# Altium project T&H_ESP32_PCB_Layout.PrjPcb
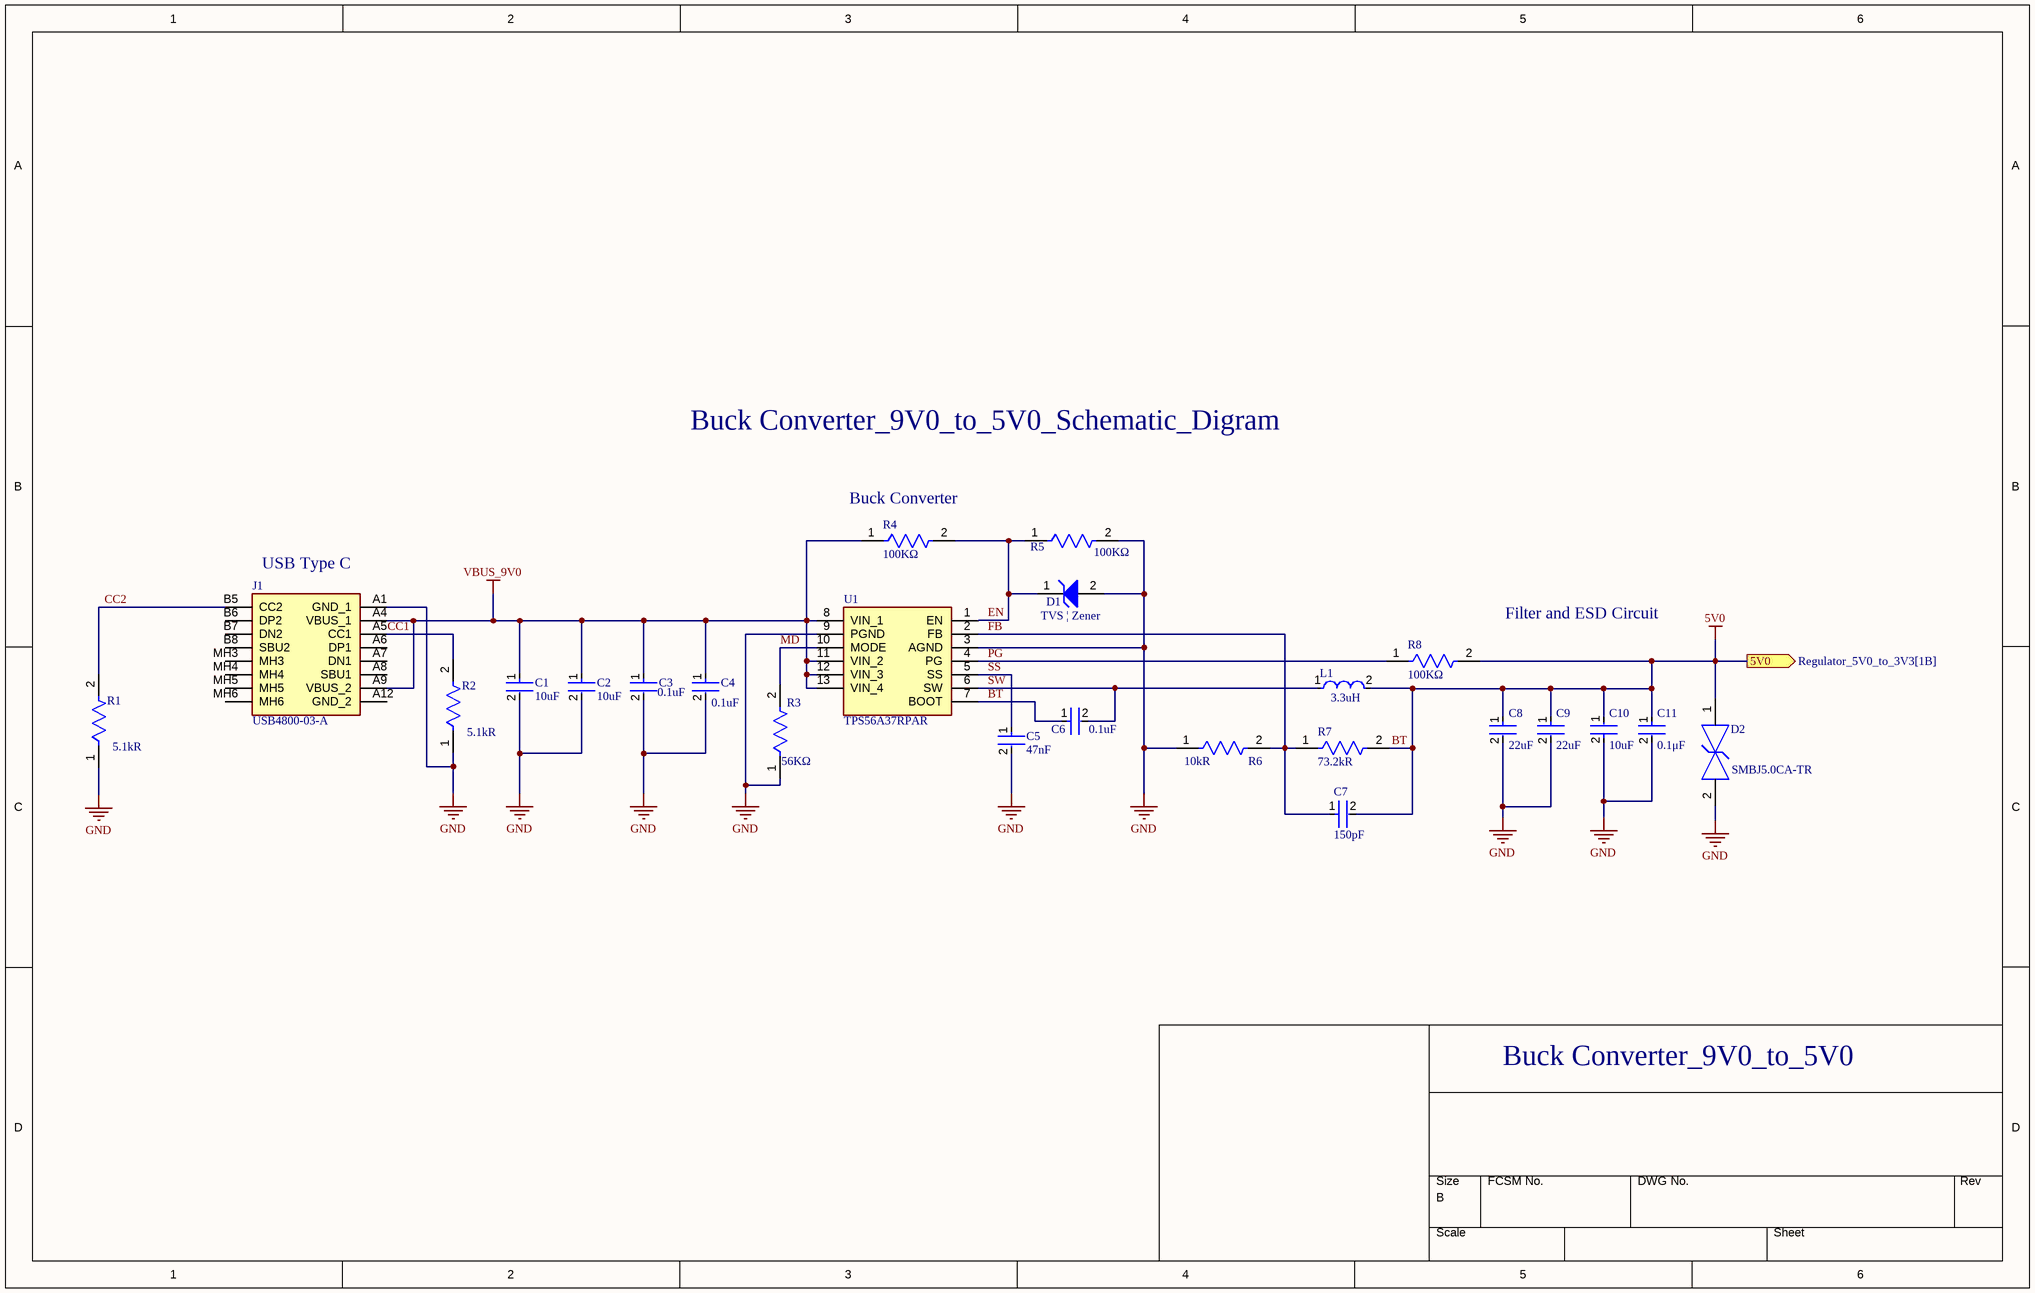
[diagram p0: Regulator_9V0_to_5V0.SchDoc]
3 sheets, 60 parts. Net scope: flat (ports and power ports of the same name join across sheets).
Board file: T&H_ESP32_PCB_Layout.PcbDoc
Sheets:
  Regulator_9V0_to_5V0.SchDoc
  Regulator_5V0_to_3V3.SchDoc
  ESP32_T&H_Interface.SchDoc

## Sheet Regulator_9V0_to_5V0.SchDoc: Buck Converter 9v to 5v0
size B; DocumentNumber: 1; Revision: 1; SheetNumber: 1; SheetTotal: 3

### Parts
C1  Capacitance: 10uF  [FP-CL21-IPC_C]  (hidden comment: CL21A106KOQNNNG)
C2  Capacitance: 10uF  [FP-CL21-IPC_C]  (hidden comment: CL21A106KOQNNNG)
C3  Capacitance: 0.1uF  [FP-0402-L_1_0_1-W_0_5_0_1-IPC_B]  (hidden comment: 0402YD104KAT2A)
C4  Capacitance: 0.1uF  [FP-0402-L_1_0_1-W_0_5_0_1-IPC_B]  (hidden comment: 0402YD104KAT2A)
C5  Capacitance: 47nF  [FP-CL579-IPC_C]  (hidden comment: CL05B473KO5NNNC)
C6  Capacitance: 0.1uF  [FP-0402-L_1_0_1-W_0_5_0_1-IPC_B]  (hidden comment: 0402YD104KAT2A)
C7  Capacitance: 150pF  [FP-C1005-050-0_05-IPC_B]  (hidden comment: C1005NP01H151J050BA)
C8  Capacitance: 22uF  [FP-CL10-IPC_B]  (hidden comment: CL10A226MO7JZNC)
C9  Capacitance: 22uF  [FP-CL10-IPC_B]  (hidden comment: CL10A226MO7JZNC)
C10  Capacitance: 10uF  [FP-C1608-080-0_1-IPC_A]  (hidden comment: C1608X5R1A106M080AC)
C11  Capacitance: 0.1μF  [FP-C0603C-CF-MFG]  (hidden comment: C0603C104K8RACTU)
D1  ESD5Z6.0T1G  [ONSC-SOD-523-2-502-01_V]  (value not drawn)
D2  SMBJ5.0CA-TR  [FP-SMB-CA-MFG]
J1  USB4800-03-A  [USB480003A]
L1  Inductance: 3.3uH  [FP-IHLP-2020CZ-FP_1_905x2-MFG]  (hidden comment: IHLP2020CZER3R3M11)
R1  Resistance: 5.1kR  [FP-CRCW0402-e3-IPC_C]  (hidden comment: CRCW04025K10FKED)
R2  Resistance: 5.1kR  [FP-CRCW0402-e3-IPC_C]  (hidden comment: CRCW04025K10FKED)
R3  Resistance: 56KΩ  [FP-CRGCQ0402-IPC_C]  (hidden comment: CRGCQ0402F56K)
R4  Resistance: 100KΩ  [FP-CRGP0402-IPC_C]  (hidden comment: CRGP0402F100K)
R5  Resistance: 100KΩ  [FP-CRGP0402-IPC_C]  (hidden comment: CRGP0402F100K)
R6  Resistance: 10kR  [FP-AC0402-MFG]  (hidden comment: AC0402FR-0710KL)
R7  Resistance: 73.2kR  [FP-RC1005-IPC_B]  (hidden comment: RC1005F7322CS)
R8  Resistance: 100KΩ  [FP-CRGP0402-IPC_C]  (hidden comment: CRGP0402F100K)
U1  TPS56A37RPAR  [TPS56A37RPAR]

### Ports
5V0 (out, see Regulator_5V0_to_3V3[1B])

### Nets
BT: C6.1 C7.2 C8.1 C9.1 C10.1 C11.1 D2.1 L1.2 R7.2 R8.2 U1.7(BOOT) ; port 5V0  [also labelled 5V0]
GND: C1.2 C2.2 C3.2 C4.2 C5.2 C8.2 C9.2 C10.2 C11.2 D1.2(A) D2.2 J1.A1(GND_1) R1.1 R2.1 R3.1 R5.2 R6.1 U1.3(AGND) U1.9(PGND)
VBUS_9V0: C1.1 C2.1 C3.1 C4.1 J1.A4(VBUS_1) J1.A9(VBUS_2) R4.1 U1.8(VIN_1) U1.11(VIN_2) U1.12(VIN_3) U1.13(VIN_4)
CC1: J1.A5(CC1) R2.2
CC2: J1.B5(CC2) R1.2
EN: D1.1(K) R4.2 R5.1 U1.1(EN)
FB: C7.1 R6.2 R7.1 U1.2(FB)
MD: R3.2 U1.10(MODE)
PG: R8.1 U1.4(PG)
SS: C5.1 U1.5(SS)
SW: C6.2 L1.1 U1.6(SW)

Not connected (* = marked no-connect by the designer): J1 A6(DP1) A7(DN1) A8(SBU1) A12(GND_2) B6(DP2) B7(DN2) B8(SBU2) MH3 MH4 MH5 MH6

### Notes on the sheet
- Buck Converter_9V0_to_5V0_Schematic_Digram
- (near R4) Buck Converter
- (near J1) USB Type C
- (near D1) TVS | Zener
- Filter and ESD Circuit
- Buck Converter_9V0_to_5V0
- DWG. NO.
- REV.
- SHT.
- THIS DOCUMENT AND THE DATA DISCLOSED HEREIN OR HEREWITH IS THE PROPERTY OF ALTIUM LIMITED AND MAY BE FREELY DISTRIBUTED IN WHOLE. NO RIGHTS ARE RESERVED OR EXPRESS OR IMPLIED WARANTEE GIVEN.
- REVISION
- DESCRIPTION
- DATE
- APPROVED
- ENG:
- APPROVALS
- PROJECT
- DSN:
- CHK:
- REFERENCE DOCUMENTS
- PROJECT REVISION:
- TITLE
- DOCUMENT REVISION:
- DESIGN ITEM:
- BOM:
- FAB DWG:
- PCB DWG:
- ASSY DWG:
- SCALE:
- SIZE
- B
- CAGE CODE
- FILE NAME
- DWG NO.
- SHEET
- OF
- REV

### Library data of the parts
C1 C2 = CMP-13271-002240-1: CL21 Series 0805 10uF 16V ±10% Tolerance X5R Multilayer Ceramic Chip Capacitor; Case Code (Metric): 2012; Package Quantity: 3000; Width: 0.049inch; Mount: Surface Mount; Depth: 1.25mm; Material: Ceramic; Min Operating Temperature: -55°C; Thickness: 0.053inch; Tolerance: 10%; Case Code (Imperial): 0805; Packaging: Tape and Reel; Voltage Rating: 16V; Case/Package: 0805; Height: 1.25mm; Voltage: 16V; Max Operating Temperature: 85°C; Length: 2mm; Dielectric: X5R
C3 C4 C6 = CMP-2008-02842-2: General Purpose Ceramic Capacitor, 0402, 10uF, 10%, X5R, 15%, 16V; Dissipation Factor: 3.5%; Case Code (Metric): 1005; Packaging: Tape and Reel; Voltage Rating: 16V; Voltage: 16V; REACH SVHC: No SVHC; Width: 0.02inch; Thickness: 0.022inch; Max Operating Temperature: 85°C; Dielectric: X5R; Mount: Surface Mount; Package Quantity: 1; Length: 1mm; Termination: SMD/SMT; Voltage Rating (DC): 16V; Construction: Flat; Contact Plating: Tin; Depth: 0.5mm; Tolerance: 10%; RoHS Compliant: Yes; Min Operating Temperature: -55°C; Case Code (Imperial): 0402; Height: 0.56mm; Case/Package: 0402; Radiation Hardening: No; Lead Free: Lead Free; Series: -
C5 = CMP-13271-000643-1: Cap Ceramic 47nF 16V X7R ±10% SMD 0402 +125°C Paper T/R; Voltage Rating (DC): 16V; Mount: Surface Mount; Max Operating Temperature: 125°C; Radiation Hardening: No; Voltage: 16V; Length: 1mm; Package Quantity: 1; Tolerance: 10%; Width: 0.02inch; Case/Package: 0402; Case Code (Metric): 1005; Height: 0.5mm; Packaging: Tape and Reel; Depth: 0.5mm; Lead Free: Lead Free; Min Operating Temperature: -55°C; Case Code (Imperial): 0402; Voltage Rating: 16V; Contact Plating: Tin; Dielectric: X7R; Thickness: 0.022inch
C7 = CMP-08246-007033-1: Multilayer Ceramic Capacitors 150pF ±5% 50V NP0 SMD 0402; Dielectric: C0G; Case Code (Imperial): 0402; Tolerance: 5%; Voltage Rating (DC): 50V; Max Operating Temperature: 150°C; RoHS Compliant: Yes; Packaging: Tape and Reel; Min Operating Temperature: -55°C; Series: C; Termination: SMD/SMT; Length: 0.039inch; Voltage Rating: 50V; Package Quantity: 10000; Weight: 2.3E-05oz; Height: 0.5mm; Mount: Surface Mount; Features: High Temperature; Width: 0.02inch; Thickness: 0.022inch; Case Code (Metric): 1005; Case/Package: 0402
C8 C9 = CMP-13271-002755-1: Cap Ceramic 22uF 16V X5R ±20% Pad SMD 0603 +85°C T/R; Mount: Surface Mount; Packaging: Tape and Reel; Case Code (Imperial): 0603; Max Operating Temperature: 85°C; Case/Package: 0603; Voltage Rating: 16V; Tolerance: 20%; Case Code (Metric): 1608; Min Operating Temperature: -55°C
C10 = CMP-2000-04980-2: Multilayer Ceramic Capacitors 10μF ±20% 10V X5R SMD 0603; Min Operating Temperature: -55°C; RoHS Compliant: Yes; Package Quantity: 1; Max Operating Temperature: 85°C; Radiation Hardening: No; Packaging: Tape and Reel; REACH SVHC: No SVHC; Length: 1.6mm; Case/Package: 0603; Series: C; Voltage Rating: 10V; Thickness: 0.035inch; Weight: 7.1E-05oz; Dielectric: X5R; Termination: SMD/SMT; Dielectric Material: Ceramic; Mount: Surface Mount; Construction: Flat; Resistor Type: Ceramic; Tolerance: 20%; Case Code (Metric): 1608; Number of Pins: 2; Case Code (Imperial): 0603; Depth: 0.8mm; Lead Free: Lead Free; Width: 0.031inch; Height: 0.8mm; Voltage Rating (DC): 10V
C11 = CMP-1035-02580-3: CAP CER 0.1UF 10V X7R 0603; Manufacturer: KEMET; Tolerance: 0.1; Material: Ceramic; Value: 0.10 μF; Temperature Coefficient: 30ppm/°C; Automotive Grade: Grade 1; Digikey Description: CAP CER 0.1UF 10V X7R 0603; Temperature Range High: +125°C; RoHS: TRUE; ComponentLink2URL: https://api.kemet.com/component-edge/download/datasheet/C0603C100J5GACAUTO.pdf; Lead Free: Yes; Device Class L2: Capacitors; Mouser Description: Multilayer Ceramic Capacitors MLCC - SMD/SMT 10volts 0.1uF X7R 10%; Temperature: -55°C to +125°C; Category: Cap; Height: 0.87mm; Voltage Rating: 10 V; Device Class L3: Ceramic Capacitors; ComponentLink2Description: Datasheet; Automotive: Yes; Manufacturer Part Number: C0603C104K8RACTU; Octopart: https://octopart.com/c0603c104k8ractu-kemet-145075; Temperature Characteristic: X7R; Device Class L1: Passive Components; Temperature Range Low: -55°C; Package: C0603C-CF
D1 = CMP-1063-00101-1: Transient Voltage Suppressor, Micro-Packaged Diode for ESD Protection, 2-Pin SOD-523, Pb-Free, Tape and Reel; Manufacturer: On Semiconductor; PPK Max (W): 181; Direction: Unidirectional; Number of Lines: 1; V(BR) Min (V): 6.8; IR Max (uA): 0.01; VRWM Max (V): 6; Packing: Tape and Reel; PackageReference: SOD-523-2-502-01; Mounting Technology: Surface Mount; RoHS: Pb-Free; ComponentLink2Description: Datasheet; PackageVersion: Rev. E, 09/2010; ComponentLink2URL: http://www.onsemi.cn/pub_link/Collateral/ESD5Z2.5T1-D.PDF; PackageDescription: 2-Pin SOD, Body 1.2 x 0.8 mm; DatasheetVersion: Rev. 10; ComponentLink3Description: Package Specification; ComponentLink3URL: http://www.onsemi.com/pub_link/Collateral/502-01.PDF; ComponentLink1URL: http://www.onsemi.com/; ComponentLink1Description: Manufacturer URL; PartNumber: ESD5Z6.0T1G
D2 = CMP-12225-000020-1: TVS DIODE 5V 13.4V SMB; Manufacturer: STMicroelectronics; Max Junction Temp: +150°C; Number Of Channels: 1; Peak Pulse Current: 68A; Standoff Height: 0.05mm; Direction: Bidirectional; Peak Pulse Power: 600W; Clamping Voltage: 9.2V; Breakdown Voltage: 6.4V; Manufacturer Part Number: SMBJ5.0CA-TR; Device Class L3: unset; Temperature Range Low: -55°C; Digikey Description: TVS DIODE 5V 13.4V SMB; Device Class L2: TVS Diodes; Mouser Description: TVS Diodes - Transient Voltage Suppressors 600W 5.0V Bidirect; Height: 2.65mm; ComponentLink2Description: Datasheet; Lead Free: Yes; RoHS: TRUE; Device Class L1: Circuit Protection; Package: SMB-CA; Reverse Standoff Voltage: 5V; ComponentLink2URL: https://www.st.com/content/ccc/resource/technical/document/datasheet/19/78/91/39/07/cd/40/65/CD00001366.pdf/files/CD00001366.pdf/_jcr_content/translations/en.CD00001366.pdf; Temperature: -55°C to +150°C; Automotive: No; Octopart: https://octopart.com/smbj5.0ca-tr-stmicroelectronics-347080; Temperature Range High: +150°C; Category: Diode
J1 = USB4800-03-A: Connector; Manufacturer_Name: GCT (GLOBAL CONNECTOR TECHNOLOGY); Datasheet Link: https://gct.co/connector/usb4800; Height: 5.58mm; Manufacturer_Part_Number: USB4800-03-A; Mouser Part Number: 640-USB4800-03-A; Mouser Price/Stock: https://www.mouser.co.uk/ProductDetail/GCT/USB4800-03-A?qs=vvQtp7zwQdMkfG8vViEZoQ%3D%3D
L1 = CMP-02424-000463-1: Fixed Inductors Commercial Low DCR Series 3.3uH 5.5A 40.4mΩ 20%; DC Resistance (DCR): 40.4mR; Self Resonant Frequency: 29MHz; Saturation Current: 7A; Test Frequency: 100kHz; Shielding: Shielded; Depth: 5.43mm; Termination: SMD/SMT; Width: 0.204inch; Packaging: Tape and Reel; Height: 3mm; Height - Seated (Max): 0.118inch; Military Standard: Not; RMS Current (Irms): 5.5A; Current Rating: 5.5A; Radiation Hardening: No; Case/Package: 2020; Tolerance: 20%; Min Operating Temperature: -55°C; Package Quantity: 2000; Contact Plating: Tin; Mount: Surface Mount; Inductance Tolerance: 20%; Length: 5.74mm; Lead Free: Lead Free; Max DC Current: 7A; Max Operating Temperature: 125°C
R1 R2 = CMP-1011-00590-4: RES Thick Film, 5.1kΩ, 1%, 0.063W, 100ppm/°C, 0402; Voltage Rating: 50V; Max Power Dissipation: 63mW; Case/Package: 0402; Min Operating Temperature: -55°C; Height: 0.35mm; Contact Plating: Tin; Tolerance: 1%; Max Operating Temperature: 155°C; Lead Free: Lead Free; Number of Terminations: 2; Temperature Coefficient: 100ppm/°C; Weight: 2.3E-05oz; Termination: SMD/SMT; Radiation Hardening: No; Voltage Rating (DC): 50V; Length: 1mm; Features: Automotive AEC-Q200; Case Code (Metric): 1005; Width: 0.02inch; Package Quantity: 10; Military Standard: Not; Depth: 0.5mm; Packaging: Tape and Reel; Power Rating: 63mW; Case Code (Imperial): 0402; Composition: Thick Film
R3 = CMP-03211-009184-1: CRGCQ 0402 56K 1%; Manufacturer: TE Connectivity; Temperature Coefficient: ±100ppm/°C; Value: 56KΩ; Voltage Rating: 50V; Power Rating: 0.0625W; Tolerance: 0.01; Device Class L3: Chip SMD Resistors; ComponentLink2URL: https://www.te.com/commerce/DocumentDelivery/DDEController?Action=showdoc&DocId=Data+Sheet%7F1773204-3%7F1%7Fpdf%7FEnglish%7FENG_DS_1773204-3_1.pdf%7F4-2176347-1092; RoHS: TRUE; Octopart: https://octopart.com/crgcq0402f56k-te+connectivity-91017978; Composition: Thick Film; Height: 0.4mm; Ipc Land Pattern Name: RESC10050X35; Series: CRGCQ; Device Class L2: Resistors; Temperature: -55°C to +155°C; Manufacturer Part Number: CRGCQ0402F56K; Device Class L1: Passive Components; Temperature Range Low: -55°C; Digikey Description: CRGCQ 0402 56K 1%; Lead Free: Yes; Automotive: Yes; ComponentLink2Description: Datasheet; Temperature Range High: +155°C; Ambient Temperature Range High: +70°C; Package: CRGCQ0402; Category: Res
R4 R5 R8 = CMP-03211-001392-1: SMD Precision Pulse Thick Film Chip Resistor; Manufacturer: TE; Value: 100KΩ; Power Rating: 0.125W; Tolerance: 0.01; Temperature Coefficient: ±100ppm/°C; Voltage Rating: 50V; Octopart: https://octopart.com/crgp0402f100k-te+connectivity-91018658; Ipc Land Pattern Name: RESC11050X35; Digikey Description: SMD Precision Pulse Thick Film Chip Resistor; Composition: Thick Film; Device Class L3: Chip SMD Resistors; Package: CRGP0402; Manufacturer Part Number: CRGP0402F100K; Temperature: -55°C to +155°C; Category: Res; Device Class L1: Passive Components; Temperature Range High: +155°C; ComponentLink2URL: https://www.mouser.ca/datasheet/2/418/NG_DS_9-1773463-9_A-1358566.pdf; Temperature Range Low: -55°C; Series: CRGP; Automotive: No; Lead Free: Yes; RoHS: TRUE; Device Class L2: Resistors; Height: 0.4mm; ComponentLink2Description: Datasheet
R6 = CMP-2002-01790-3: RES 10kΩ ±1% 0.063W 0402; Power Rating: 62.5mW; Voltage Rating: 50V; Temperature Coefficient: 100ppm/°C; Max Power Dissipation: 63mW; Tolerance: 1%; Military Standard: Not; Construction: Rectangular; Termination: SMD/SMT; Max Operating Temperature: 155°C; Min Operating Temperature: -55°C; Height: 0.015inch; Lead Free: Lead Free; Width: 0.02inch; Case/Package: 0402; Resistor Type: Thick Film; Series: AC; Features: Moisture Resistant; RoHS Compliant: Yes; Number of Terminations: 2; Case Code (Metric): 1005; Length: 0.039inch; Depth: 0.5mm; Size Code: 0402; Packaging: Tape and Reel; Case Code (Imperial): 0402
R7 = CMP-13261-004133-1: Res Thick Film 0402 73.2kΩ 1% 0.063W ±100ppm/°C Molded SMD T/R; Voltage Rating (DC): 50V; Power Rating: 63mW; Tolerance: 1%; Contact Plating: Tin; Features: Moisture Resistant; Case Code (Imperial): 0402; Length: 1mm; Lead Free: Lead Free; Case Code (Metric): 1005; Packaging: Tape and Reel; Number of Terminations: 2; Max Operating Temperature: 155°C; Military Standard: Not; Height: 0.016inch; Case/Package: 0402; Radiation Hardening: No; Depth: 0.5mm; Min Operating Temperature: -55°C; Temperature Coefficient: 100ppm/°C; Max Power Dissipation: 63mW; Composition: Thick Film; Width: 0.02inch; Package Quantity: 1
U1 = TPS56A37RPAR: Integrated Circuit; Manufacturer_Name: Texas Instruments; Datasheet Link: https://www.ti.com/lit/ds/symlink/tps56a37.pdf?ts=1708310049261&ref_url=https%253A%252F%252Fwww.ti.com%252Fproduct%252FTPS56A37; Height: 1mm; Manufacturer_Part_Number: TPS56A37RPAR; Mouser Part Number: 595-TPS56A37RPAR; Mouser Price/Stock: https://www.mouser.co.uk/ProductDetail/Texas-Instruments/TPS56A37RPAR?qs=dbcCsuKDzFV3BmG4b9YeGQ%3D%3D; Arrow Part Number: TPS56A37RPAR; Arrow Price/Stock: https://www.arrow.com/en/products/tps56a37rpar/texas-instruments?utm_currency=USD&region=nac

## Sheet Regulator_5V0_to_3V3.SchDoc: Linear Voltage Regulator_5V0_to_3V3
size A4; Date: 03/08/2025; DocumentNumber: 2; Revision: 0; SheetNumber: 2; SheetTotal: 3
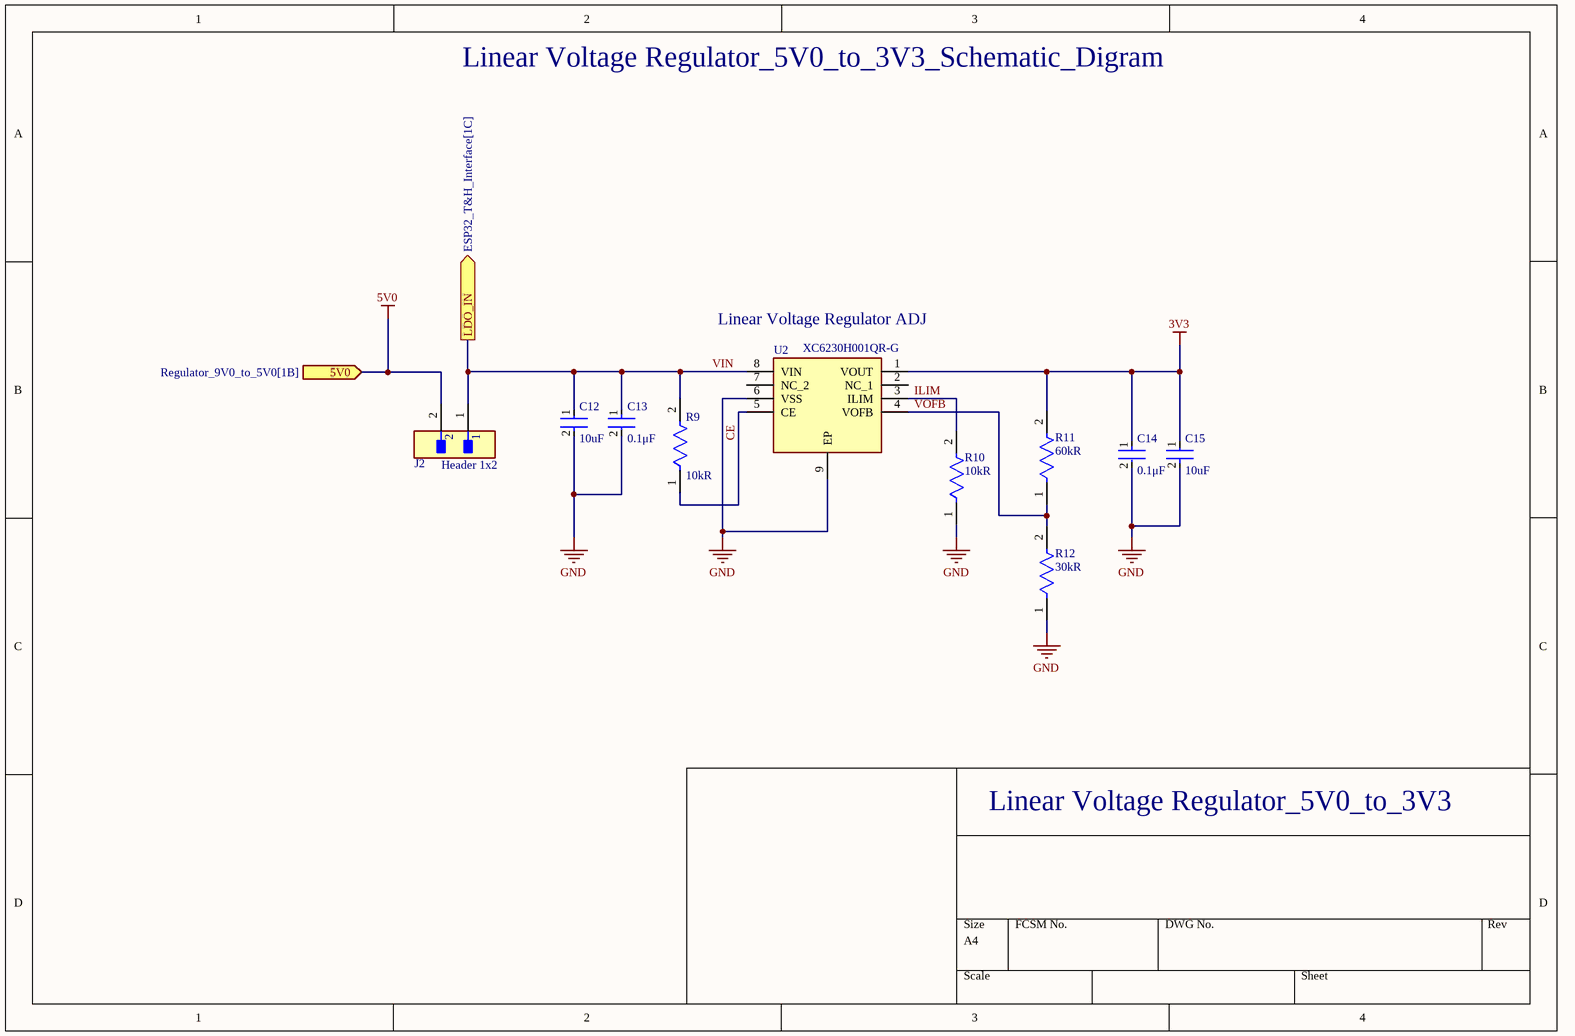
[diagram p1: Regulator_5V0_to_3V3.SchDoc]

### Parts
C12  Capacitance: 10uF  [FP-C1608-080-0_1-IPC_A]  (hidden comment: C1608X5R1A106M080AC)
C13  Capacitance: 0.1μF  [FP-C0603C-CF-MFG]  (hidden comment: C0603C104K8RACTU)
C14  Capacitance: 0.1μF  [FP-C0603C-CF-MFG]  (hidden comment: C0603C104K8RACTU)
C15  Capacitance: 10uF  [FP-C1608-080-0_1-IPC_A]  (hidden comment: C1608X5R1A106M080AC)
J2  Header 1x2  [FP-M20-9990245-MFG]
R9  Resistance: 10kR  [FP-AC0402-MFG]  (hidden comment: AC0402FR-0710KL)
R10  Resistance: 10kR  [FP-AC0402-MFG]  (hidden comment: AC0402FR-0710KL)
R11  Resistance: 60kR  [FP-MCR01-IPC_A]  (hidden comment: MCR01MRTF3002)
R12  Resistance: 30kR  [FP-MCR01-IPC_A]  (hidden comment: MCR01MRTF3002)
U2  XC6230H001QR-G  [XC6230H001]

### Ports
5V0 (in, see Regulator_9V0_to_5V0[1B]), LDO_IN (out, see ESP32_T&H_Interface[1C])

### Nets
3V3: C14.1 C15.1 R11.2 U2.1(VOUT)
5V0: J2.2 ; port 5V0  [project net BT]
GND: C12.2 C13.2 C14.2 C15.2 R10.1 R12.1 U2.6(VSS) U2.9(EP)
CE: R9.1 U2.5(CE)
ILIM: R10.2 U2.3(ILIM)
VIN: C12.1 C13.1 J2.1 R9.2 U2.8(VIN) ; port LDO_IN
VOFB: R11.1 R12.2 U2.4(VOFB)

Not connected (* = marked no-connect by the designer): U2 2(NC_1) 7(NC_2)

### Notes on the sheet
- Linear Voltage Regulator_5V0_to_3V3_Schematic_Digram
- (near U2) Linear Voltage Regulator ADJ
- Linear Voltage Regulator_5V0_to_3V3

### Library data of the parts
C12 C15 = CMP-2000-04980-2: as C10 on sheet Regulator_9V0_to_5V0; Min Operating Temperature: -55°C; RoHS Compliant: Yes; Package Quantity: 1; Max Operating Temperature: 85°C; Radiation Hardening: No; Packaging: Tape and Reel; REACH SVHC: No SVHC; Length: 1.6mm; Case/Package: 0603; Series: C; Voltage Rating: 10V; Thickness: 0.035inch; Weight: 7.1E-05oz; Dielectric: X5R; Termination: SMD/SMT; Dielectric Material: Ceramic; Mount: Surface Mount; Construction: Flat; Resistor Type: Ceramic; Tolerance: 20%; Case Code (Metric): 1608; Number of Pins: 2; Case Code (Imperial): 0603; Depth: 0.8mm; Lead Free: Lead Free; Width: 0.031inch; Height: 0.8mm; Voltage Rating (DC): 10V
C13 C14 = CMP-1035-02580-3: as C11 on sheet Regulator_9V0_to_5V0; Digikey Description: CAP CER 0.1UF 10V X7R 0603; Temperature Range High: +125°C; RoHS: TRUE; ComponentLink2URL: https://api.kemet.com/component-edge/download/datasheet/C0603C100J5GACAUTO.pdf; Lead Free: Yes; Device Class L2: Capacitors; Mouser Description: Multilayer Ceramic Capacitors MLCC - SMD/SMT 10volts 0.1uF X7R 10%; Temperature: -55°C to +125°C; Category: Cap; Height: 0.87mm; Voltage Rating: 10 V; Device Class L3: Ceramic Capacitors; ComponentLink2Description: Datasheet; Automotive: Yes; Manufacturer Part Number: C0603C104K8RACTU; Octopart: https://octopart.com/c0603c104k8ractu-kemet-145075; Temperature Characteristic: X7R; Device Class L1: Passive Components; Temperature Range Low: -55°C; Package: C0603C-CF
J2 = CMP-15831-000105-1: CONN HEADER VERT 2POS 2.54MM; Working Voltage: 750V; Gender: Male; Number of Poles: 2; Current Rating: 3A; Mated Stacking Heights: 16.54mm; Contact Resistance: 25mR; Connector Type: Male Pin; Insulation Resistance: 10GR; Mating Cycles: 300; Voltage: 50V; Flammability Rating: UL94 V-0; Pitch: 2.54mm; Series: M20; Number of Contacts: 2; Height: 0.12inch; Min Operating Temperature: -40°C; Contact Finish - Mating: GOLD; Number of Positions: 2; Number of Rows: 1; Packaging: Bulk; Package Quantity: 1000; Voltage Rating (AC): 750V; Current: 3A; Mount: Through Hole; Case/Package: SIL; Orientation: Straight; Contact Shape: Square; Weight: 0.25lb; Radiation Hardening: No; Fastening Type: Pull; Length: 5.08mm; Depth: 2.54mm; Contact Mating Length: 0.24inch; Housing Material: Nylon; Reach SVHC Compliant: Yes; Insulation Material: Nylon; Color: Black; Width: 0.25inch; Insulation Color: Black; Contact Material: Brass; Contact Type: Male Pin; Termination: Solder; Max Operating Temperature: 105°C; Contact Plating: Gold; Housing Color: Black; Max Current Rating: 3A; Lead Pitch: 2.54mm
R9 R10 = CMP-2002-01790-3: as R6 on sheet Regulator_9V0_to_5V0; Tolerance: 1%; Military Standard: Not; Construction: Rectangular; Termination: SMD/SMT; Max Operating Temperature: 155°C; Min Operating Temperature: -55°C; Height: 0.015inch; Lead Free: Lead Free; Width: 0.02inch; Case/Package: 0402; Resistor Type: Thick Film; Series: AC; Features: Moisture Resistant; RoHS Compliant: Yes; Number of Terminations: 2; Case Code (Metric): 1005; Length: 0.039inch; Depth: 0.5mm; Size Code: 0402; Packaging: Tape and Reel; Case Code (Imperial): 0402
R11 = CMP-08839-016222-1: Thick Film Chip Resistor, 0402, 60kΩ, 1%, 100ppm/°C, 0.063W, 50V; Max Power Dissipation: 63mW; Voltage Rating (DC): 50V; Min Operating Temperature: -55°C; Case Code (Metric): 1005; RoHS Compliant: Yes; Case/Package: 0402; Number of Terminations: 2; Case Code (Imperial): 0402; Height: 0.016inch; Tolerance: 1%; Resistor Type: Thick Film; Length: 0.039inch; Max Operating Temperature: 155°C; Temperature Coefficient: 100ppm/°C; Package Quantity: 10000; Packaging: Tape and Reel; Width: 0.02inch
R12 = CMP-08839-016222-1: Thick Film Chip Resistor, 0402, 30kΩ, 1%, 100ppm/°C, 0.063W, 50V; Max Power Dissipation: 63mW; Voltage Rating (DC): 50V; Min Operating Temperature: -55°C; Case Code (Metric): 1005; RoHS Compliant: Yes; Case/Package: 0402; Number of Terminations: 2; Case Code (Imperial): 0402; Height: 0.016inch; Tolerance: 1%; Resistor Type: Thick Film; Length: 0.039inch; Max Operating Temperature: 155°C; Temperature Coefficient: 100ppm/°C; Package Quantity: 10000; Packaging: Tape and Reel; Width: 0.02inch
U2 = XC6230H001QR-G: Integrated Circuit; Manufacturer_Name: Torex; Datasheet Link: https://torex.componentsearchengine.com/Datasheets/2/XC6230H001QR-G.pdf; Height: 1.75mm; Manufacturer_Part_Number: XC6230H001QR-G; Mouser Part Number: 865-XC6230H001QR-G; Mouser Price/Stock: https://www.mouser.co.uk/ProductDetail/Torex-Semiconductor/XC6230H001QR-G?qs=T3oQrply3y%252BzJb5jKbBeQw%3D%3D

## Sheet ESP32_T&H_Interface.SchDoc
size A; SheetNumber: 3; SheetTotal: 3
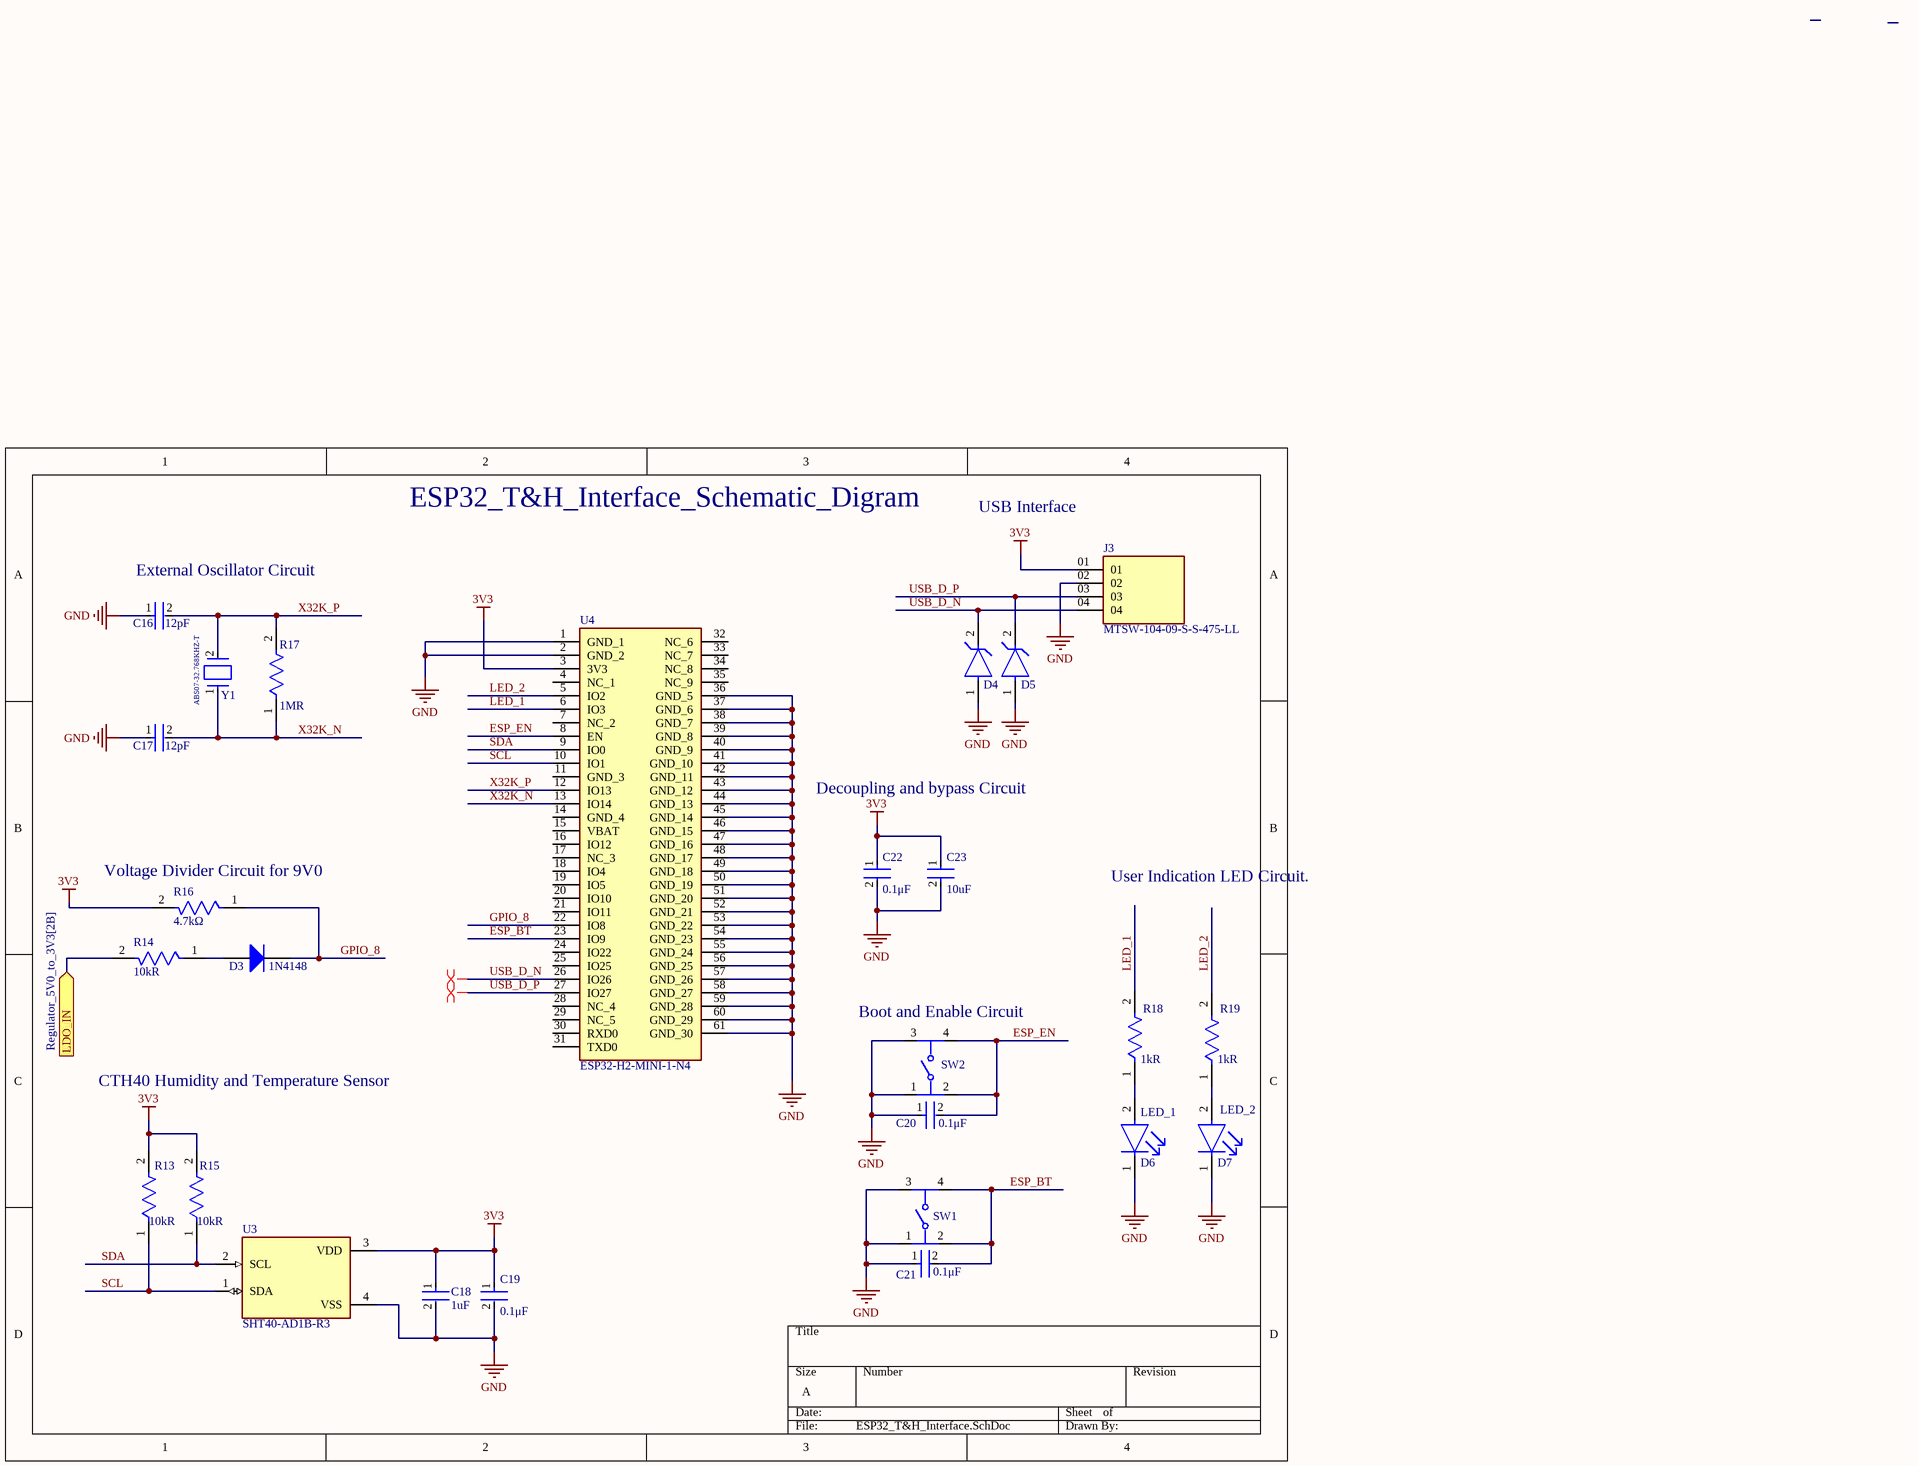
[diagram p2: ESP32_T&H_Interface.SchDoc]

### Parts
C16  Capacitance: 12pF  [FP-0402-L_1_0_1-W_0_5_0_1-IPC_B]  (hidden comment: 04025A120JAT2A)
C17  Capacitance: 12pF  [FP-0402-L_1_0_1-W_0_5_0_1-IPC_B]  (hidden comment: 04025A120JAT2A)
C18  Capacitance: 1uF  [FP-GRM15-0_1-MFG]  (hidden comment: GRM155R61A105KE15D)
C19  Capacitance: 0.1μF  [FP-C0603C-CF-MFG]  (hidden comment: C0603C104K8RACTU)
C20  Capacitance: 0.1μF  [FP-C0603C-CF-MFG]  (hidden comment: C0603C104K8RACTU)
C21  Capacitance: 0.1μF  [FP-C0603C-CF-MFG]  (hidden comment: C0603C104K8RACTU)
C22  Capacitance: 0.1μF  [FP-C0603C-CF-MFG]  (hidden comment: C0603C104K8RACTU)
C23  Capacitance: 10uF  [FP-C1608-080-0_1-IPC_A]  (hidden comment: C1608X5R1A106M080AC)
D3  1N4148  [DIOD-SOD323-2-A_V]
D4  UCLAMP3601P.TNT  [FP-SLP1006P2-MFG]  (value not drawn)
D5  UCLAMP3601P.TNT  [FP-SLP1006P2-MFG]  (value not drawn)
D6  APHHS1005CGCK  [FP-APHHS1005CGCK-MFG]  (value not drawn)
D7  APHHS1005CGCK  [FP-APHHS1005CGCK-MFG]  (value not drawn)
J3  MTSW-104-09-S-S-475-LL  [SAMTEC_MTSW-104-09-S-S-475-LL]
R13  Resistance: 10kR  [FP-AC0402-MFG]  (hidden comment: AC0402FR-0710KL)
R14  Resistance: 10kR  [FP-AC0402-MFG]  (hidden comment: AC0402FR-0710KL)
R15  Resistance: 10kR  [FP-AC0402-MFG]  (hidden comment: AC0402FR-0710KL)
R16  Resistance: 4.7kΩ  [FP-RC0402-0_4-MFG]  (hidden comment: RC0402JR-074K7L)
R17  Resistance: 1MR  [FP-MCR01-IPC_B]  (hidden comment: MCR01MRTF1004)
R18  Resistance: 1kR  [FP-RMCF0402-MFG]  (hidden comment: RMCF0402FT1K00)
R19  Resistance: 1kR  [FP-RMCF0402-MFG]  (hidden comment: RMCF0402FT1K00)
SW1  KMR221NGLFS  [FP-KMR221NGLFS-0]  (value not drawn)
SW2  KMR221NGLFS  [FP-KMR221NGLFS-0]  (value not drawn)
U3  SHT40-AD1B-R3  [SHT4X]
U4  ESP32-H2-MINI-1-N4  [ESP32H2MINI1N4]
Y1  ABS07-32.768KHZ-T  [FP-ABS07-MFG]

### Ports
LDO_IN (in, see Regulator_5V0_to_3V3[2B])

### Nets
3V3: C18.1 C19.1 C22.1 C23.1 J3.01 R13.2 R15.2 R16.2 U3.3(VDD) U4.3(3V3)
GND: C16.1 C17.1 C18.2 C19.2 C20.1 C21.1 C22.2 C23.2 D4.1(A) D5.1(A) D6.1(C) D7.1(C) J3.02 SW1.1 SW1.3 SW2.1 SW2.3 U3.4(VSS) U4.1(GND_1) U4.2(GND_2) U4.36(GND_5) U4.37(GND_6) U4.38(GND_7) U4.39(GND_8) U4.40(GND_9) U4.41(GND_10) U4.42(GND_11) U4.43(GND_12) U4.44(GND_13) U4.45(GND_14) U4.46(GND_15) U4.47(GND_16) U4.48(GND_17) U4.49(GND_18) U4.50(GND_19) U4.51(GND_20) U4.52(GND_21) U4.53(GND_22) U4.54(GND_23) U4.55(GND_24) U4.56(GND_25) U4.57(GND_26) U4.58(GND_27) U4.59(GND_28) U4.60(GND_29) U4.61(GND_30)
ESP_BT: C21.2 SW1.2 SW1.4 U4.23(IO9)
ESP_EN: C20.2 SW2.2 SW2.4 U4.8(EN)
GPIO_8: D3.2(K) R16.1 U4.22(IO8)
LED_1: R18.2 U4.6(IO3)
LED_2: R19.2 U4.5(IO2)
SCL: R13.1 U3.1(SDA) U4.10(IO1)
SDA: R15.1 U3.2(SCL) U4.9(IO0)
USB_D_N: D4.2(C) J3.04 U4.26(IO26)
USB_D_P: D5.2(C) J3.03 U4.27(IO27)
VIN: R14.2 ; port LDO_IN
X32K_N: C17.2 R17.1 U4.13(IO14) Y1.1
X32K_P: C16.2 R17.2 U4.12(IO13) Y1.2
NetD3_1: D3.1(A) R14.1
NetD6_2: D6.2(A) R18.1
NetD7_2: D7.2(A) R19.1

Not connected (* = marked no-connect by the designer): U4 4(NC_1) 7(NC_2) 11(GND_3) 14(GND_4) 15(VBAT) 16(IO12) 17(NC_3) 18(IO4) 19(IO5) 20(IO10) 21(IO11) 24(IO22) 25(IO25) 28(NC_4) 29(NC_5) 30(RXD0) 31(TXD0) 32(NC_6) 33(NC_7) 34(NC_8) 35(NC_9)

### Layout directives
differential pair: USB_D_N, USB_D_P

### Notes on the sheet
- ESP32_T&H_Interface_Schematic_Digram
- USB Interface
- (near C16) External Oscillator Circuit
- Decoupling and bypass Circuit
- (near R16) Voltage Divider Circuit for 9V0
- User Indication LED Circuit.
- (near SW2) Boot and Enable Circuit
- CTH40 Humidity and Temperature Sensor
- (near D6) LED_1
- (near D7) LED_2

### Library data of the parts
C16 C17 = CMP-2008-02574-2: General Purpose Ceramic Capacitor, 0402, 12pF, 5%, C0G, 30ppm/°C, 50V; Insulation Resistance: 100GR; Radiation Hardening: No; RoHS Compliant: Yes; Voltage Rating: 50V; Case Code (Imperial): 0402; Height: 0.5mm; Voltage: 50V; Voltage Rating (DC): 50V; Mount: Surface Mount; Thickness: 0.022inch; Depth: 0.5mm; Max Operating Temperature: 125°C; Construction: Flat; Termination: SMD/SMT; Tolerance: 5%; Length: 1mm; Lead Free: Lead Free; Dielectric: C0G; Number of Pins: 2; Package Quantity: 1; Series: -; Temperature Coefficient: 30ppm/°C; Min Operating Temperature: -55°C; Case/Package: 0402; Packaging: Tape and Reel; Case Code (Metric): 1005; Width: 0.02inch; REACH SVHC: No SVHC
C18 = CMP-2008-04556-2: CAP CER 1UF 10V X5R 0402; Manufacturer: Murata; Material: Ceramic; Tolerance: 10%; Temperature Coefficient: 15%; Octopart: https://octopart.com/grm155r61a105ke15d-murata-197442; Manufacturer Part Number: GRM155R61A105KE15D; Lead Free: Yes; ComponentLink2Description: Datasheet; Temperature: -55°C to +85°C; Temperature Range High: +85°C; Height: 0.55mm; Ipc Land Pattern Name: CAPC10050X50; ComponentLink2URL: https://search.murata.co.jp/Ceramy/image/img/A01X/G101/ENG/GRM155R61A105KE15-01A.pdf; Temperature Range Low: -55°C; Device Class L2: Capacitors; Voltage Rating: 10V; RoHS: TRUE; Device Class L1: Passive Components; Device Class L3: Ceramic Capacitors; Temperature Characteristic: X5R; Mouser Description: 0402 1 uF 10 V ±10% Tolerance X5R Surface Mount Multilayer Ceramic Capacitor; Automotive: No; Package: GRM15-0.1; Digikey Description: CAP CER 1UF 10V X5R 0402; Value: 1uF; Category: Cap
C19-C22 = CMP-1035-02580-3: as C11 on sheet Regulator_9V0_to_5V0; Digikey Description: CAP CER 0.1UF 10V X7R 0603; Temperature Range High: +125°C; RoHS: TRUE; ComponentLink2URL: https://api.kemet.com/component-edge/download/datasheet/C0603C100J5GACAUTO.pdf; Lead Free: Yes; Device Class L2: Capacitors; Mouser Description: Multilayer Ceramic Capacitors MLCC - SMD/SMT 10volts 0.1uF X7R 10%; Temperature: -55°C to +125°C; Category: Cap; Height: 0.87mm; Voltage Rating: 10 V; Device Class L3: Ceramic Capacitors; ComponentLink2Description: Datasheet; Automotive: Yes; Manufacturer Part Number: C0603C104K8RACTU; Octopart: https://octopart.com/c0603c104k8ractu-kemet-145075; Temperature Characteristic: X7R; Device Class L1: Passive Components; Temperature Range Low: -55°C; Package: C0603C-CF
C23 = CMP-2000-04980-2: as C10 on sheet Regulator_9V0_to_5V0; Min Operating Temperature: -55°C; RoHS Compliant: Yes; Package Quantity: 1; Max Operating Temperature: 85°C; Radiation Hardening: No; Packaging: Tape and Reel; REACH SVHC: No SVHC; Length: 1.6mm; Case/Package: 0603; Series: C; Voltage Rating: 10V; Thickness: 0.035inch; Weight: 7.1E-05oz; Dielectric: X5R; Termination: SMD/SMT; Dielectric Material: Ceramic; Mount: Surface Mount; Construction: Flat; Resistor Type: Ceramic; Tolerance: 20%; Case Code (Metric): 1608; Number of Pins: 2; Case Code (Imperial): 0603; Depth: 0.8mm; Lead Free: Lead Free; Width: 0.031inch; Height: 0.8mm; Voltage Rating (DC): 10V
D3 = CMP-1667-00004-1: Fast Switching Diode, 75 V, 0.3 A, -65 to 150 degC, 2-Pin SOD323, RoHS, Tape and Reel; DatasheetVersion: Rev. 25-2, 03/2016; PackageDescription: 2-Pin Small Outline Diode, Body 1.7 x 1.3 mm; ComponentLink2Description: Datasheet; ComponentLink1URL: http://www.diodes.com/; PackageReference: SOD323-2; ComponentLink2URL: http://www.diodes.com/datasheets/ds30097.pdf; ComponentLink1Description: Manufacturer URL
D4 D5 = CMP-56445-000005-1: TVS DIODE 33VWM 60VC SLP1006P2; Direction: Unidirectional; Min Breakdown Voltage: 36V; Leakage Current: 1uA; Peak Pulse Power: 125W; Power Line Protection: No; Number of Unidirectional Channels: 1; Clamping Voltage: 60V; Peak Pulse Current: 2A; Power Dissipation: 170W; Diode Type: ZENER; Element Configuration: Single; Reverse Standoff Voltage: 33V; Max Breakdown Voltage: 45V; Max Operating Temperature: 125°C; Resistor Type: Zener; Series: Automotive, AEC-Q100, uClamp®; Min Operating Temperature: -40°C; Case Code (Imperial): 0402; Number of Pins: 2; Lead Free: Lead Free; Case/Package: SMD/SMT; RoHS Compliant: Yes; Packaging: Tape and Reel; Clamping Voltage-Max: 60V; Depth: 0.6mm; Case Code (Metric): 1006; Length: 1mm; Radiation Hardening: No; Mount: Surface Mount; Working Voltage: 33V
D6 D7 = CMP-44529-000044-1: LED GREEN CLEAR CHIP SMD; Viewing Angle: 120°; Dominant Wavelength: 570nm; Test Current: 20mA; Luminous Intensity: 50mcd; Forward Voltage: 2.1V; Number of LEDs: 1; Lens Color: Clear; Packaging: Tape and Reel; Max Operating Temperature: 85°C; Illumination Color: Green; Length: 1mm; Mount: Surface Mount; Lens Style: Clear; Color: Green; Number of Pins: 2; Wavelength: 570nm; Case/Package: 0402; Width: 0.5mm; Package Quantity: 2000; Case Code (Metric): 1005; Height: 0.6mm; Lead Free: Lead Free; Case Code (Imperial): 0402; Forward Current: 20mA; Min Operating Temperature: -40°C
R13-R15 = CMP-2002-01790-3: as R6 on sheet Regulator_9V0_to_5V0; Tolerance: 1%; Military Standard: Not; Construction: Rectangular; Termination: SMD/SMT; Max Operating Temperature: 155°C; Min Operating Temperature: -55°C; Height: 0.015inch; Lead Free: Lead Free; Width: 0.02inch; Case/Package: 0402; Resistor Type: Thick Film; Series: AC; Features: Moisture Resistant; RoHS Compliant: Yes; Number of Terminations: 2; Case Code (Metric): 1005; Length: 0.039inch; Depth: 0.5mm; Size Code: 0402; Packaging: Tape and Reel; Case Code (Imperial): 0402
R16 = CMP-2002-08011-2: Tolerance: 5%; Power Rating: 63mW; Voltage Rating: 50V; Temperature Coefficient: 100ppm/°C; Composition: Thick Film; Max Operating Temperature: 155°C; Case/Package: 0402; Depth: 500µm; Packaging: Tape & Reel; Number of Pins: 2; Schedule B: 8533210045, 8533210045; Case Code (Imperial): 0402; Termination: SMD/SMT; Military Standard: Not; Lead Free: Lead Free; Width: 500µm; REACH SVHC: No SVHC; Max Power Dissipation: 63mW; Voltage Rating (AC): 50V; Features: Moisture Resistant; Min Operating Temperature: -55°C; Number of Terminations: 2; RoHS: Compliant; Height: 350µm; Voltage Rating (DC): 50V; Length: 1mm
R17 = CMP-08839-019445-1: Thick Film Chip Resistor, 0402, 1MΩ, 1%, 100ppm/°C, 0.063W, 50V; Max Power Dissipation: 63mW; Lead Free: Lead Free; Case Code (Imperial): 0402; Max Operating Temperature: 155°C; Package Quantity: 1; Length: 0.039inch; Temperature Coefficient: 100ppm/°C; Case Code (Metric): 1005; Tolerance: 1%; Case/Package: 0402; RoHS Compliant: Yes; Number of Terminations: 2; Resistor Type: Thick Film; Height: 0.016inch; Packaging: Tape and Reel; Min Operating Temperature: -55°C; Voltage Rating (DC): 50V; Width: 0.02inch; Series: MCR
R18 R19 = CMP-26527-000026-1: 1kΩ ±1% 0.063W 0402 Thick Film Chip Resistor AEC-Q200 compliant; Temperature Coefficient: 100ppm/°C; Power Rating: 63mW; Length: 1mm; RoHS Compliant: Yes; Construction: Rectangular; Height: 0.016inch; Size Code: 0402; Lead Free: Lead Free; Radiation Hardening: No; Tolerance: 1%; Width: 0.02inch; Military Standard: Not; Resistor Type: Thick Film; Number of Terminations: 2; Min Operating Temperature: -55°C; Max Operating Temperature: 155°C; Depth: 0.5mm; Features: Automotive AEC-Q200; Packaging: Tape and Reel; Case Code (Metric): 1005; Mount: Surface Mount; Contact Plating: Tin; Max Power Dissipation: 63mW; Case/Package: 0402; Case Code (Imperial): 0402; Series: RMCF
SW1 SW2 = CMP-10040-000006-1: SWITCH TACTILE SPST-NO 0.05A 32V; Manufacturer: C&K; Contact Current Rating: 50mA; Operating Force: 2N; Contact Resistance: 100mΩ; Electromechanical Life: 200000Cycles; Digikey Description: SWITCH TACTILE SPST-NO 0.05A 32V; Manufacturer Part Number: KMR221NGLFS; Octopart: https://octopart.com/kmr221nglfs-c%26k+components-7203802; Package: 0; Temperature: -40°C to +85°C; Mount: Surface Mount; Device Class L2: Switches; Height: 1.9mm; Device Class L3: Tactile Switches; RoHS: TRUE; Lead Free: Yes; ComponentLink2Description: Datasheet; Device Class L1: Electromechanical; Automotive: No; Mouser Description: Tactile Switches Tact; Category: Switch; Temperature Range High: +85°C; Temperature Range Low: -40°C; Voltage Rating Dc: 32V; ComponentLink2URL: https://dznh3ojzb2azq.cloudfront.net/products/Tactile/KMR2/documents/datasheet.pdf; Throw Configuration: SPST-NO
U3 = SHT40-AD1B-R3: Digital Relative Humidity Temperature Sensor, Â±1.8 / max 3.5 %RH, Â±0.2 Â°C, Ultra-Low-Power, with filtermembrane; MF: Sensirion; SnapEDA_Link: https://www.snapeda.com/parts/SHT40-AD1B-R3/Sensirion/view-part/?ref=snap; Price: None; Purchase-URL: https://pricing.snapeda.com/search/part/SHT40-AD1B-R3/?ref=eda; Check_prices: https://www.snapeda.com/parts/SHT40-AD1B-R3/Sensirion/view-part/?ref=eda; MP: SHT40-AD1B-R3; Availability: In Stock; Value: *; Package: Package
U4 = ESP32-H2-MINI-1-N4: Integrated Circuit; Manufacturer_Name: Espressif Systems; Datasheet Link: https://www.espressif.com/sites/default/files/documentation/esp32-h2-mini-1_mini-1u_datasheet_en.pdf; Height: 2.55mm; Manufacturer_Part_Number: ESP32-H2-MINI-1-N4; Mouser Part Number: 356-ESP32H2MINI1-N4; Mouser Price/Stock: https://www.mouser.co.uk/ProductDetail/Espressif-Systems/ESP32-H2-MINI-1-N4?qs=Jm2GQyTW%2FbiM%252BAVlvjt4eQ%3D%3D
Y1 = CMP-0447-00001-4: Crystal 32.768kHz ±20ppm (Tol) 12.5pF FUND 70kΩ 2-Pin CSMD T/R; ESR (Equivalent Series Resistance): 70kR; Radiation Hardening: No; Frequency: 32.768kHz; Length: 3.2mm; Max Operating Temperature: 85°C; Number of Pins: 2; Series: ABS07; Min Operating Temperature: -40°C; Frequency Tolerance: 20ppm; Packaging: Tape and Reel; Height: 0.9mm; Width: 1.5mm; Depth: 1.5mm; Load Capacitance: 12.5pF; RoHS Compliant: Yes; Tolerance: 20ppm; Termination: SMD/SMT; Lead Free: Lead Free; Series Resistance: 70kR; REACH SVHC: No SVHC; Case/Package: CSMD; Operating Frequency: 32.768 kHz; Package Quantity: 3000
J3 = MTSW-104-09-S-S-475-LL: Package: None; MP: MTSW-104-09-S-S-475-LL; Price: None; Availability: Unavailable; Value: *

## Nets that join several sheets
3V3: Regulator_5V0_to_3V3 (C14.1 C15.1 R11.2 U2.1), ESP32_T&H_Interface (10 pins)
BT: Regulator_9V0_to_5V0 (11 pins), Regulator_5V0_to_3V3 (J2.2)
GND: Regulator_9V0_to_5V0 (19 pins), Regulator_5V0_to_3V3 (8 pins), ESP32_T&H_Interface (46 pins)
VIN: Regulator_5V0_to_3V3 (5 pins), ESP32_T&H_Interface (R14.2)

## Assembly variants
Variant_of_T&H_ESP32_Surflow_Test_Layout: all parts fitted